# Altium schematic sheet BLE MCU,Watch Dog and Reset,EEPROM,Buzzer.SchDoc
size A4
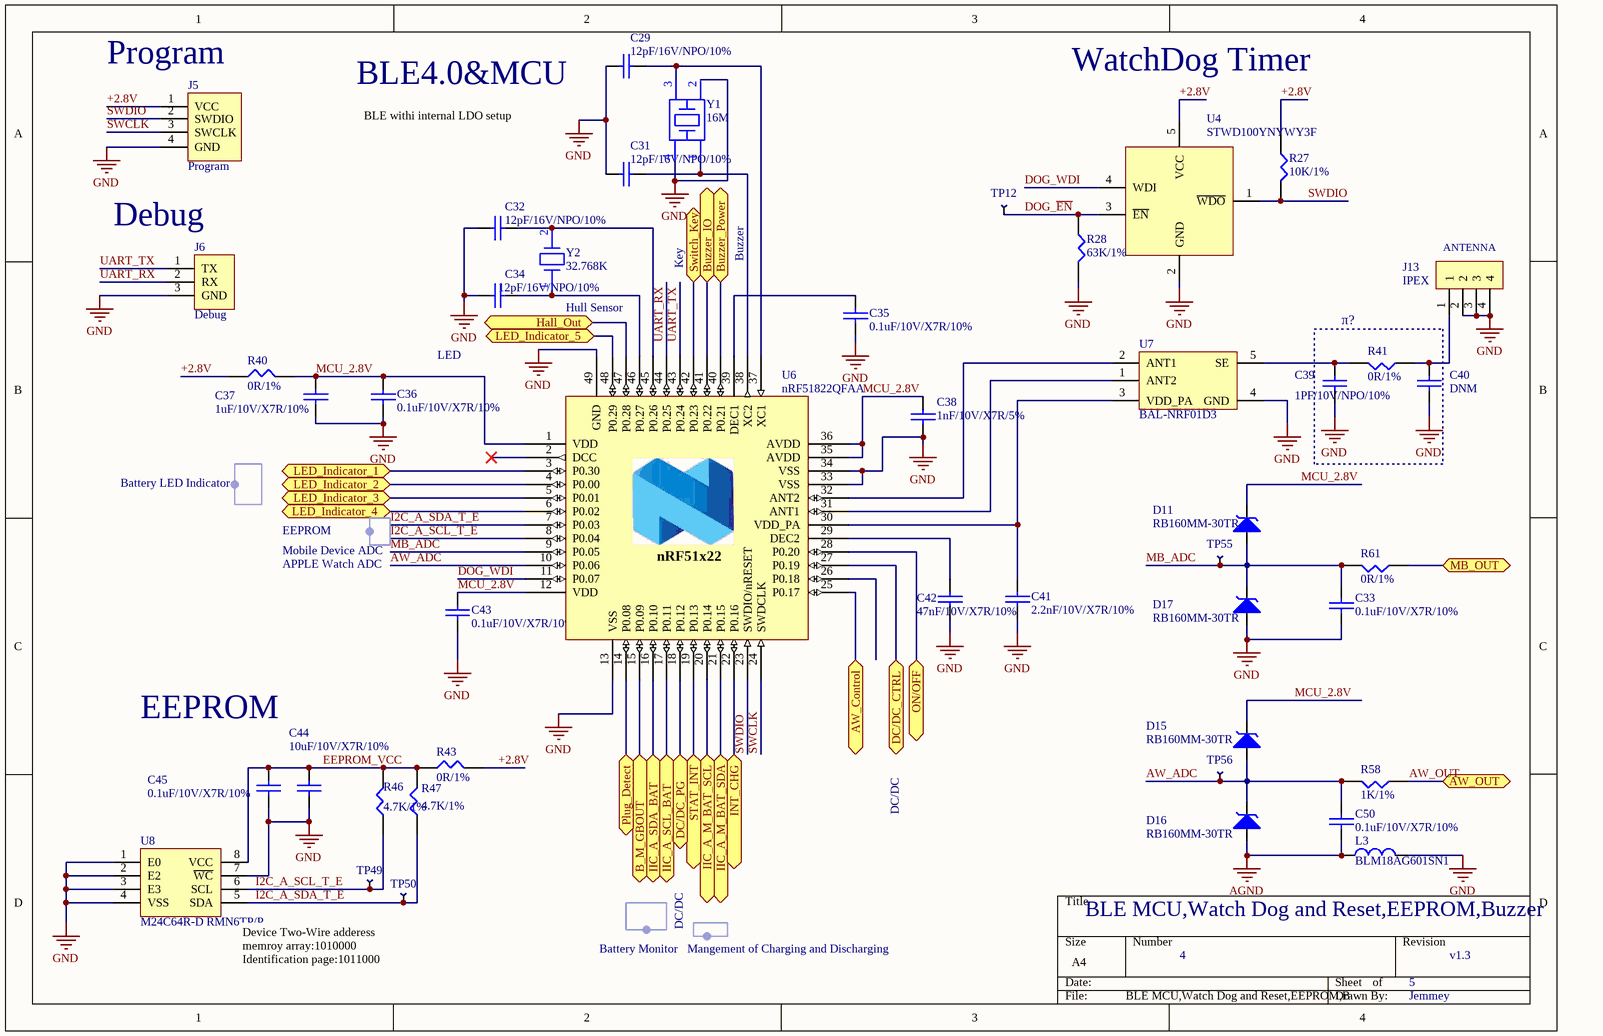
[diagram p0: BLE MCU,Watch Dog and Reset,EEPROM,Buzzer.SchDoc]

## Parts
C29  12pF/16V/NPO/10%  [0402C]
C31  12pF/16V/NPO/10%  [0402C]
C32  12pF/16V/NPO/10%  [0402C]
C33  0.1uF/10V/X7R/10%  [0402C]
C34  12pF/16V/NPO/10%  [0402C]
C35  0.1uF/10V/X7R/10%  [0402C]
C36  0.1uF/10V/X7R/10%  [0402C]
C37  1uF/10V/X7R/10%  [0402C]
C38  1nF/10V/X7R/5%  [0402C]
C39  1PF/10V/NPO/10%  [0402C]
C40  DNM  [0402C]
C41  2.2nF/10V/X7R/10%  [0402C]
C42  47nF/10V/X7R/10%  [0402C]
C43  0.1uF/10V/X7R/10%  [0402C]
C44  10uF/10V/X7R/10%  [0603C]
C45  0.1uF/10V/X7R/10%  [0402C]
C50  0.1uF/10V/X7R/10%  [0402C]
D11  RB160MM-30TR  [DO-214AC]
D15  RB160MM-30TR  [DO-214AC]
D16  RB160MM-30TR  [DO-214AC]
D17  RB160MM-30TR  [DO-214AC]
J5  Program  [PROGRAM - 1.27]
J6  Debug  [Debug- 1.27]
J13  IPEX  [IPEX]
L3  BLM18AG601SN1  [0603R]
R27  10K/1%  [0402R]
R28  63K/1%  [0402R]
R40  0R/1%  [0603R]
R41  0R/1%  [0402R]
R43  0R/1%  [0603R]
R46  4.7K/1%  [0402R]
R47  4.7K/1%  [0402R]
R58  1K/1%  [0402R]
R61  0R/1%  [0402R]
TP12  TEST  [Test Pad]  (value not drawn)
TP49  TEST  [Test Pad]  (value not drawn)
TP50  TEST  [Test Pad]  (value not drawn)
TP55  TEST  [Test Pad]  (value not drawn)
TP56  TEST  [Test Pad]  (value not drawn)
U4  STWD100YNYWY3F  [SOT23-5]
U6  nRF51822QFAA  [QFN48]
U7  BAL-NRF01D3  [ECOPACK]
U8  M24C64R-D RMN6TP/P  [SO8N]
Y1  16M  [XTALSMD2-2520]
Y2  32.768K  [XTALSMD2-3215]

## Blocks framed on the sheet
π?: C39 C40 R41

## Ports
AW_Control, AW_OUT (bidir), B_M_GBOUT, Buzzer_IO, Buzzer_Power, DC/DC_CTRL (bidir), DC/DC_PG (bidir), Hall_Out (bidir), IIC_A_M_BAT_SCL (bidir), IIC_A_M_BAT_SDA (bidir), IIC_A_SCL_BAT (bidir), IIC_A_SDA_BAT (bidir), INT_CHG, LED_Indicator_1 (bidir), LED_Indicator_2 (bidir), LED_Indicator_3 (bidir), LED_Indicator_4, LED_Indicator_5, MB_OUT (bidir), ON/OFF (bidir), Plug_Detect (bidir), STAT_INT, Switch_Key

## Harnesses
Battery Monitor: 
EEPROM: 
Mangement of Charging and Discharging: 
Battery LED Indicator: 

## Nets
AGND: C50.2 D16.2(A) L3.1
GND: C29.1 C31.1 C32.1 C33.2 C34.1 C35.1 C36.1 C37.1 C38.1 C39.2 C40.2 C41.1 C42.1 C43.1 C44.2 C45.2 D17.2(A) J5.4(GND) J6.3(GND) J13.2 J13.3 J13.4 L3.2 R28.2 U4.2(GND) U6.13(VSS) U6.33(VSS) U6.34(VSS) U6.49(GND) U7.4(GND) U8.1(E0) U8.2(E2) U8.3(E3) U8.4(VSS) U8.7(~{WC}) Y1.2 Y1.4
+2.8V: J5.1(VCC) R27.1 R40.1 R43.2 U4.5(VCC)
AW_ADC: C50.1 D15.2(A) D16.1(K) R58.2 TP56.1 U6.10(P0.06)
AW_Control: U6.25(P0.17) ; port AW_Control
AW_OUT: R58.1 ; port AW_OUT
B_M_GBOUT: U6.15(P0.09) ; port B_M_GBOUT
Buzzer_IO: U6.41(P0.22) ; port Buzzer_IO
Buzzer_Power: U6.40(P0.21) ; port Buzzer_Power
DC/DC_CTRL: U6.27(P0.19) ; port DC/DC_CTRL
DC/DC_PG: U6.18(P0.12) ; port DC/DC_PG
DOG_~{EN}: R28.1 TP12.1 U4.3(~{EN})
DOG_WDI: U4.4(WDI) U6.11(P0.07)
EEPROM_VCC: C44.1 C45.1 R43.1 R46.2 R47.2 U8.8(VCC)
Hall_Out: U6.47(P0.28) ; port Hall_Out
I2C_A_SCL_T_E: R46.1 TP49.1 U6.8(P0.04) U8.6(SCL)
I2C_A_SDA_T_E: R47.1 TP50.1 U6.7(P0.03) U8.5(SDA)
IIC_A_M_BAT_SCL: U6.20(P0.14) ; port IIC_A_M_BAT_SCL
IIC_A_M_BAT_SDA: U6.21(P0.15) ; port IIC_A_M_BAT_SDA
IIC_A_SCL_BAT: U6.17(P0.11) ; port IIC_A_SCL_BAT
IIC_A_SDA_BAT: U6.16(P0.10) ; port IIC_A_SDA_BAT
INT_CHG: U6.22(P0.16) ; port INT_CHG
LED_Indicator_1: U6.3(P0.30) ; port LED_Indicator_1
LED_Indicator_2: U6.4(P0.00) ; port LED_Indicator_2
LED_Indicator_3: U6.5(P0.01) ; port LED_Indicator_3
LED_Indicator_4: U6.6(P0.02) ; port LED_Indicator_4
LED_Indicator_5: U6.48(P0.29) ; port LED_Indicator_5
MB_ADC: C33.1 D11.2(A) D17.1(K) R61.2 TP55.1 U6.9(P0.05)
MB_OUT: R61.1 ; port MB_OUT
MCU_2.8V: C36.2 C37.2 C38.2 C43.2 D11.1(K) D15.1(K) R40.2 U6.1(VDD) U6.12(VDD) U6.35(AVDD) U6.36(AVDD)
ON/OFF: U6.28(P0.20) ; port ON/OFF
Plug_Detect: U6.14(P0.08) ; port Plug_Detect
STAT_INT: U6.19(P0.13) ; port STAT_INT
SWCLK: J5.3(SWCLK) U6.24(SWDCLK)
SWDIO: J5.2(SWDIO) R27.2 U4.1(~{WDO}) U6.23(SWDIO/nRESET)
Switch_Key: U6.42(P0.23) ; port Switch_Key
UART_RX: J6.2(RX) U6.44(P0.25)
UART_TX: J6.1(TX) U6.43(P0.24)
NetC29_2: C29.2 U6.37(XC1) Y1.3
NetC31_2: C31.2 U6.38(XC2) Y1.1
NetC32_2: C32.2 U6.45(P0.26) Y2.2
NetC34_2: C34.2 U6.46(P0.27) Y2.1
NetC35_2: C35.2 U6.39(DEC1)
NetC39_1: C39.1 R41.2 U7.5(SE)
NetC40_1: C40.1 J13.1 R41.1
NetC41_2: C41.2 U6.30(VDD_PA) U7.3(VDD_PA)
NetC42_2: C42.2 U6.29(DEC2)
NetU6_31: U6.31(ANT1) U7.1(ANT2)
NetU6_32: U6.32(ANT2) U7.2(ANT1)

Not connected (* = marked no-connect by the designer): U6 2(DCC)* 26(P0.18)

## Notes on the sheet
- (near J5) Program
- BLE4.0&MCU
- WatchDog Timer
- BLE withi internal LDO setup
- Debug
- (near J13) ANTENNA
- (near Y2) Hull Sensor
- Key
- Buzzer
- LED
- APPLE Watch ADC
- Mobile Device ADC
- EEPROM
- DC/DC
- (near L3) BLE MCU,Watch Dog and Reset,EEPROM,Buzzer
- Device Two-Wire adderess
  memroy array:1010000
  Identification page:1011000
- 4
- 5
- v1.3
- Jemmey
- (in symbol nR) nRF51x22

## Library data of the parts
C29 C31 C32 C34 = CAP: 厂家：Murata，型号：GRM1555C1H120JA01D
C33 C35 C36 C43 C45 C50 = CAP: 厂家：Murata，型号：GRM155R71A104KA01D
C37 = CAP: 厂家：Murata，型号：GRM155R61C105KA12D
C38 = CAP: 厂家：Murata，型号：GRM1555C1H102JA01D
C39 = CAP: 厂家：Murata，型号：GRM1555C1H1R0BA01D
C40 = CAP: None
C41 = CAP: 厂家：Murata，型号：GRM155R71H222KA01D
C42 = CAP: 厂家：Murata，型号：GRM155R71H473KE14D
C44 = CAP: 厂家：Murata，型号：GRM188R61A106KE69D
D11 D15-D17 = Sc: 厂家：ROHM，型号：RB160MM-30TR
J5 = Program: 厂家：暂定，型号：暂定
J6 = Debug_1: 厂家：暂定，型号：暂定
J13 = ANTA: 厂家：Molex，型号：73420110_sd
L3 = CHOKE: 厂家：MURATA，型号：BLM18AG601SN1
R27 = RES1: 厂家：Yageo，型号：RC0402FR-0710KL
R28 = RES1: 厂家：Yageo，型号：RC0402FR-0763KL
R40 R41 R43 R58 R61 = RES1: 厂家：Yageo，型号：RC0402FR-070RL
R46 R47 = RES1: 厂家：Yageo，型号：RC0402FR-074K7L
TP12 TP49 TP50 TP55 TP56 = TEST: Test Point
U4 = S: 厂家：ST，型号：STWD100YNYWY3F
U6 = nR: 厂家：Nordic，型号：Nrf51822QFAA
U7 = BAL-NRF01D3: 厂家：ST，型号：BAL-NRF01D3
U8 = M24C64-R: 厂家：ST，型号：M24C64R-D RMN6TP/P
Y1 = CRYSTAL2: 厂家：EPSON，型号：Q24FA20H0004400
Y2 = CR: 厂家：EPSON，型号：Q13FC1350000400